# EAGLE design CS-I-SW-SPST (EAGLE 6.4)
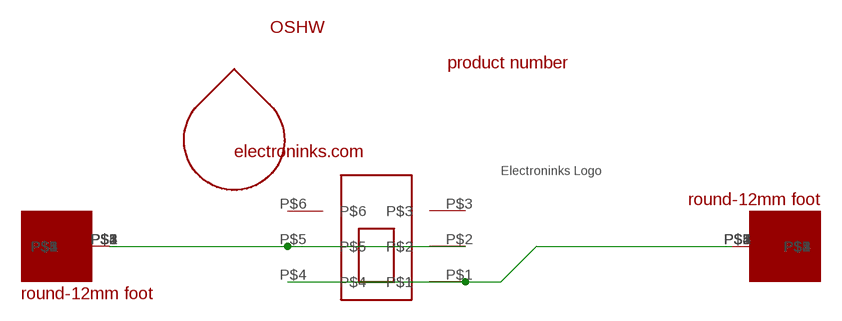
[diagram p0: schematic, sheet 1]

## Parts
U$1  ROUND-12MM-FOOT-1.8MM  [ROUND-12MM-FOOT]
U$2  ROUND-12MM-FOOT-1.8MM  [ROUND-12MM-FOOT]
U$3  ELECTRONINKS_LOGO_15MM  [ELECTRONINKS_LOGO_15MM]
U$4  ELECTRONINKS_COM_15MM  [ELECTRONINKS_COM_15MM]
U$5  CL-SB-22A-02T-SLIDE-SWITCH-TUCKED-PADS  [CL-SB-22A-02T-DPDT-COMPACT-SWITCH]
U$6  DROPLET_LOGO_4MM  [DROPLET_LOGO_4MM]
U$7  OSHW_4MM  [OHSW_4MM]
U$8  CS_I_SW_SPST  [CS_I_SW_SPST]

## Nets
N$1: U$1.P$1 U$5.P$1 U$5.P$4
N$3: U$2.P$1 U$5.P$2 U$5.P$5
Unconnected: U$1.P$2 U$1.P$3 U$1.P$4 U$1.P$5 U$2.P$2 U$2.P$3 U$2.P$4 U$2.P$5 U$5.P$3 U$5.P$6

## Library data of the parts
U$1 U$2 = electroninks:ROUND-12MM-FOOT-1.8MM
U$3 = electroninks:ELECTRONINKS_LOGO_15MM
U$4 = electroninks:ELECTRONINKS_COM_15MM
U$5 = electroninks:CL-SB-22A-02T-SLIDE-SWITCH-TUCKED-PADS
U$6 = electroninks:DROPLET_LOGO_4MM
U$7 = electroninks:OSHW_4MM
U$8 = electroninks:CS_I_SW_SPST

## Board
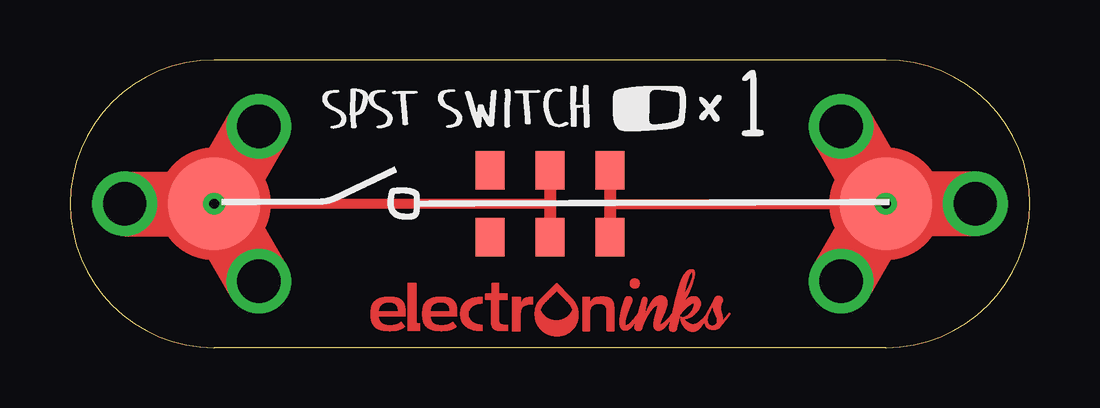
[diagram p1: board, top side]
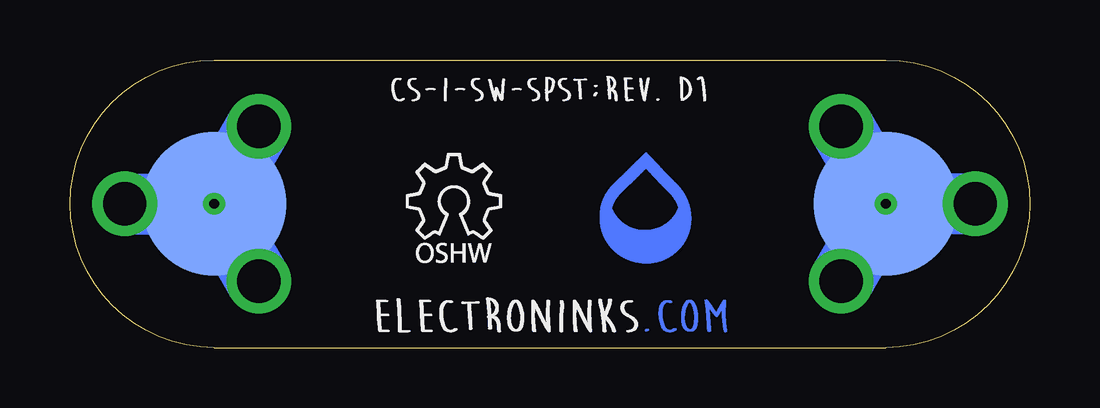
[diagram p2: board, bottom side, seen from below]

Size 40 x 12 mm. Coordinates in mm from the lower left corner, seen from the top.
Outline: 34,0 arc180 34,12 6,12 arc180 6,0 34,0
Copper layers (1*16): Top 0.035mm / dielectric 1.5mm / Bottom 0.035mm
Design rules "default": minimum track width 10mil, minimum drill 24mil, track to track 8mil, track to pad 8mil, pad to pad 8mil, via to via 8mil, smd to smd 8mil, copper to edge 40mil, drill to drill 8mil, minimum pad ring 10mil, minimum via ring 8mil, stop-mask expansion 4mil, vias tented up to drill 0mil, thermal gap 10mil

### Footprints (pad centres in the part's own frame; a part is rotated, then mirrored left to right if it is on the bottom)
ROUND-12MM-FOOT = drill 1.8: P$1 -3.726,0; P$2 1.863,3.227; P$3 1.863,-3.227 | smd 3.85 x 3.85: P$4 0,0 | smd 6 x 6 bottom: P$5 0,0 | drill 0.4: P$6 0,0
CL-SB-22A-02T-DPDT-COMPACT-SWITCH = smd 1.2 x 1.6: P$1 -2.5,-1.4; P$2 0,-1.4; P$3 2.5,-1.4; P$4 -2.5,1.4; P$5 0,1.4; P$6 2.5,1.4

### Placement (x,y rotation side)
U$1  34,6 180 top
U$2  6,6 0 top
U$3  12.52,0.47 0 top
U$4  27.5,0.25 0 bottom
U$5  20,6 180 top
U$6  16,5 0 bottom
U$7  26,3.25 0 bottom
U$8  26.75,10 0 bottom

### Tracks (layer width: path | path; a pad name or v marks a point on that pad's centre or on a via)
N$1
  Top 0.406: U$5.P$1 22.5,6 34,6
  Top 0.5: U$5.P$1 U$5.P$4
N$3
  Top 0.406: U$5.P$5 20,6 6,6
  Top 0.5: U$5.P$2 U$5.P$5